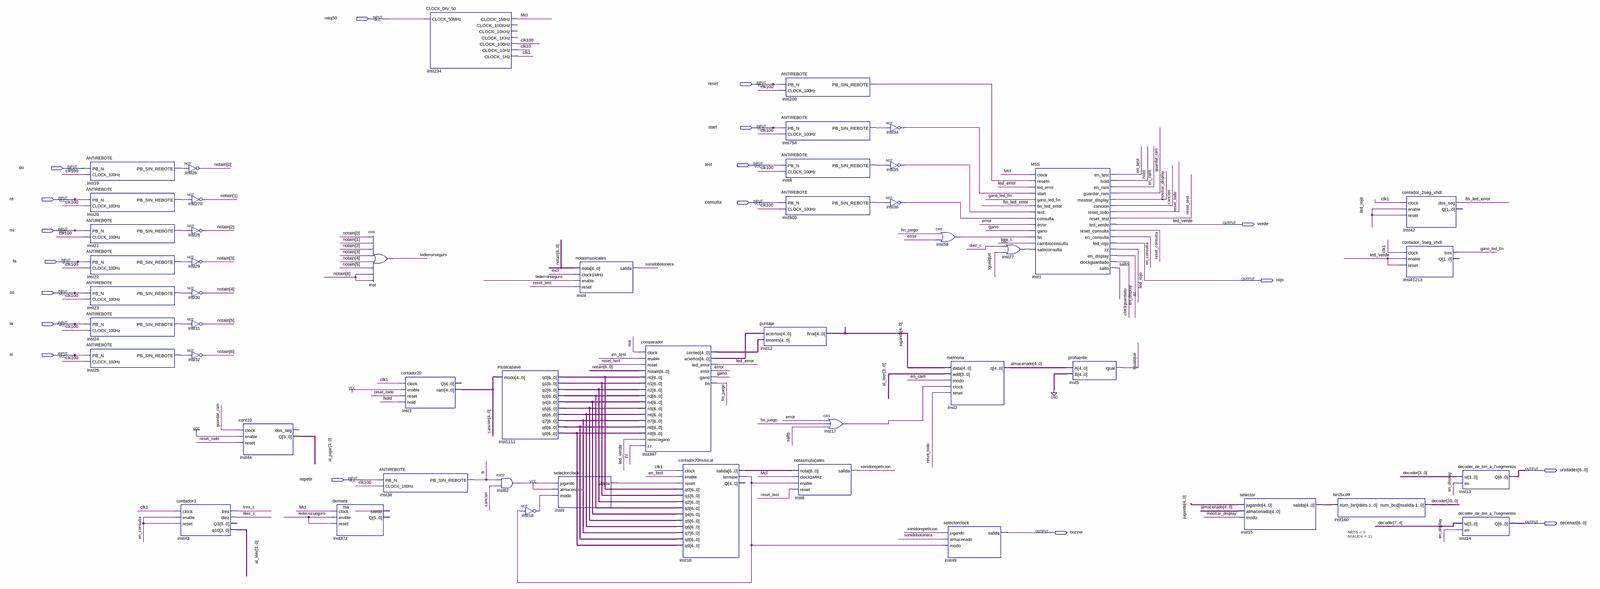
[diagram p0: schematic sheet, whole]
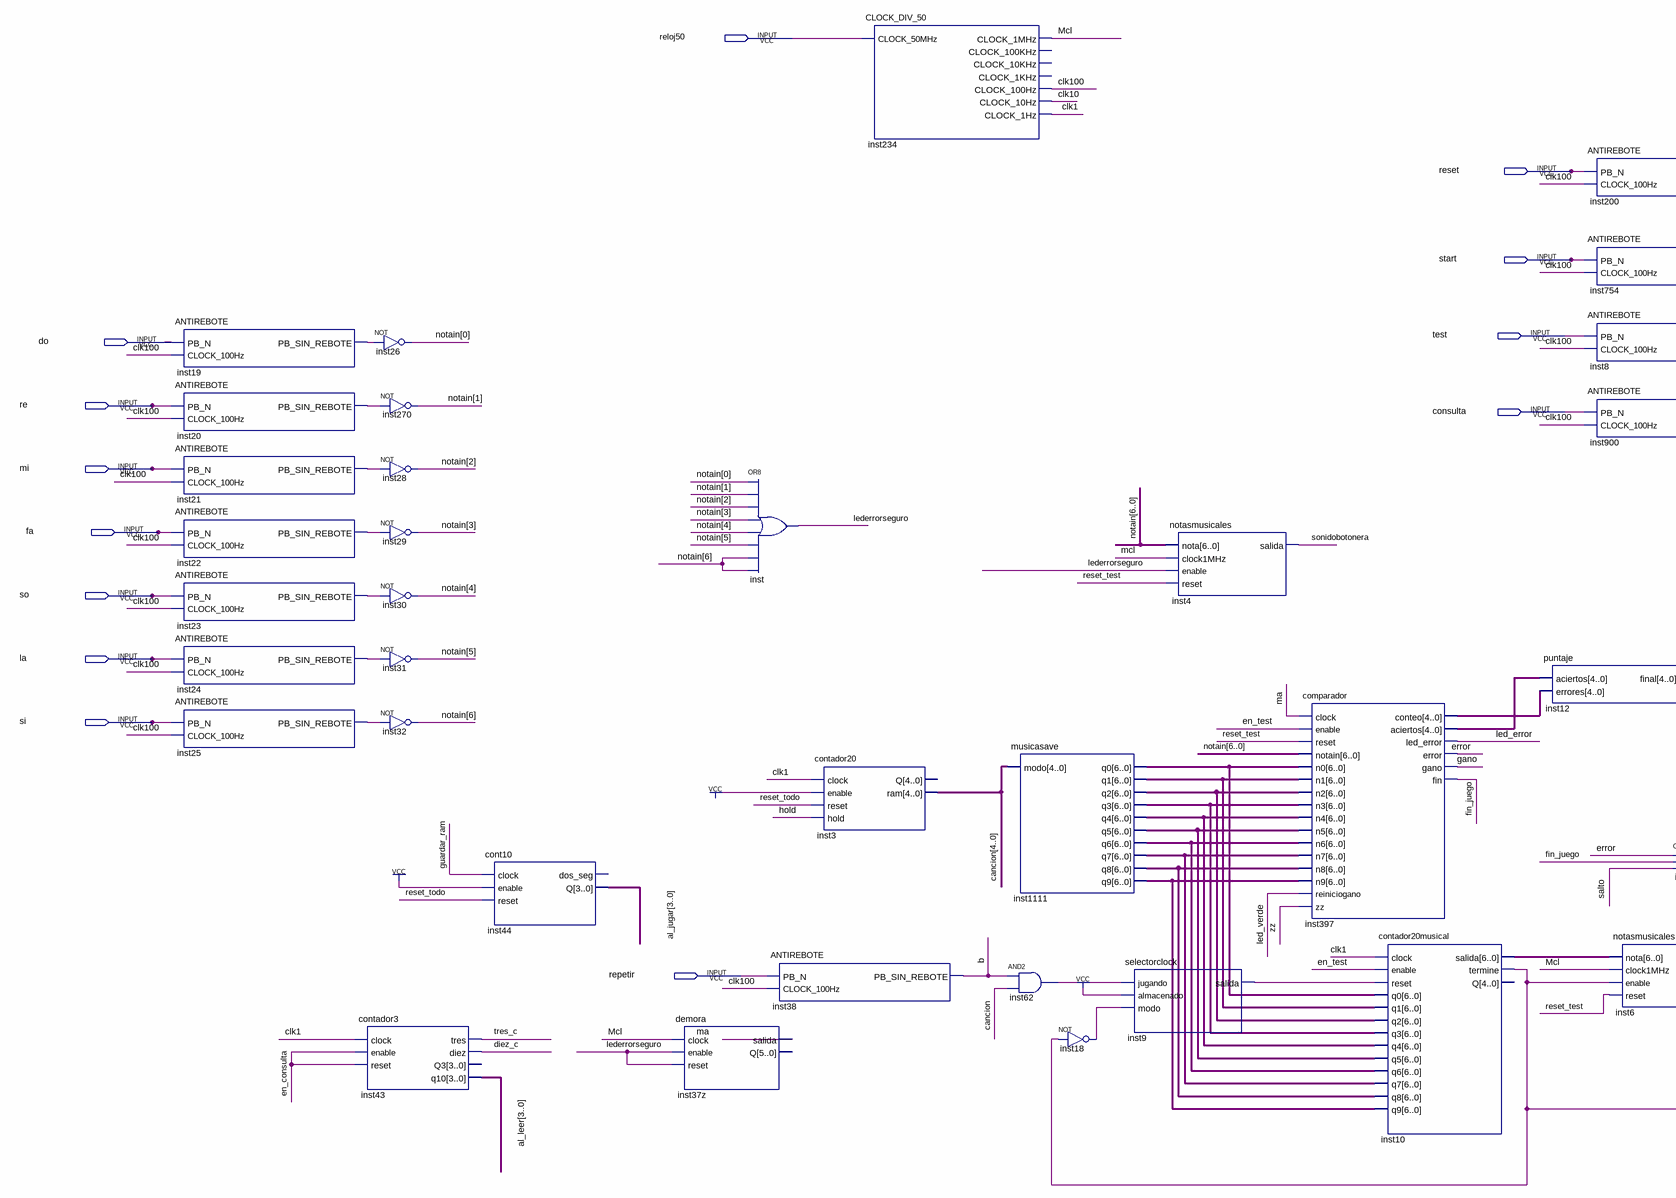
[diagram p1: schematic sheet, left part]
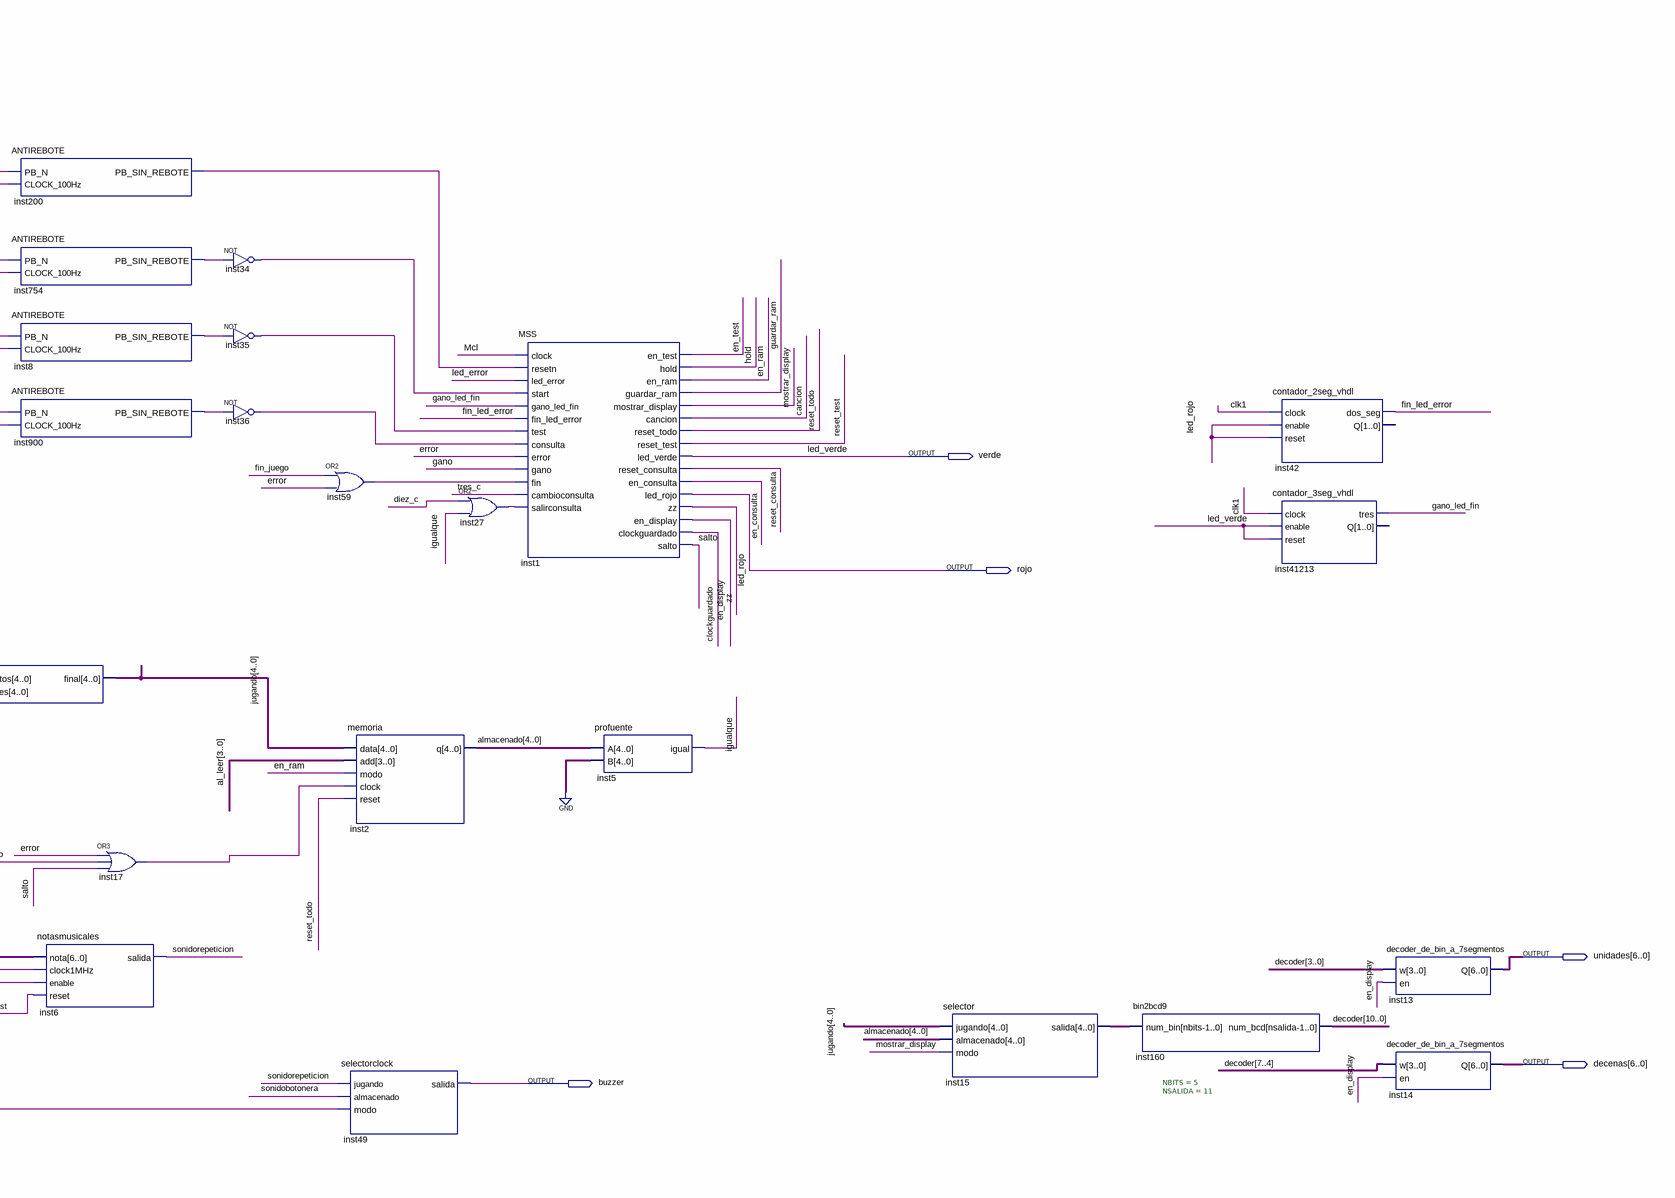
[diagram p2: schematic sheet, right part]
// Quartus schematic musica.bdf as structural Verilog: 50 symbols, 18 pins
module musica (
  input  reloj50,
  input  reset,
  input  start,
  input  test,
  input  \do ,
  input  re,
  input  consulta,
  input  mi,
  input  fa,
  input  so,
  input  la,
  input  si,
  input  repetir,
  output verde,
  output rojo,
  output [6:0] unidades,
  output [6:0] decenas,
  output buzzer
);

  wire b, cancion_1bit, clk1, clk10, clk100, clockguardado, diez_c, en_consulta, en_display, en_ram, en_test,
       error, fin_juego, fin_led_error, gano, gano_led_fin, guardar_ram, hold, igualque, inst8_pb_sin_rebote,
       inst9_salida, inst10_termine, inst17_out, inst18_out, inst19_pb_sin_rebote, inst20_pb_sin_rebote,
       inst21_pb_sin_rebote, inst22_pb_sin_rebote, inst23_pb_sin_rebote, inst24_pb_sin_rebote,
       inst25_pb_sin_rebote, inst27_out, inst34_out, inst35_out, inst36_out, inst59_out, inst62_out,
       inst200_pb_sin_rebote, inst754_pb_sin_rebote, inst900_pb_sin_rebote, led_error, lederrorseguro, ma,
       Mcl, mostrar_display, reset_consulta, reset_test, reset_todo, salto, sonidobotonera, sonidorepeticion,
       tres_c, zz;
  wire [3:0] al_jugar, al_leer;
  wire [4:0] almacenado, cancion, inst15_salida, inst397_aciertos, inst397_conteo, jugando;
  wire [6:0] inst10_salida, inst1111_q0, inst1111_q1, inst1111_q2, inst1111_q3, inst1111_q4, inst1111_q5,
       inst1111_q6, inst1111_q7, inst1111_q8, inst1111_q9, notain;
  wire [10:0] decoder;

  ANTIREBOTE inst19 (.PB_N(\do ), .CLOCK_100Hz(clk100), .PB_SIN_REBOTE(inst19_pb_sin_rebote));
  ANTIREBOTE inst20 (.PB_N(re), .CLOCK_100Hz(clk100), .PB_SIN_REBOTE(inst20_pb_sin_rebote));
  ANTIREBOTE inst21 (.PB_N(mi), .CLOCK_100Hz(clk100), .PB_SIN_REBOTE(inst21_pb_sin_rebote));
  ANTIREBOTE inst22 (.PB_N(fa), .CLOCK_100Hz(clk100), .PB_SIN_REBOTE(inst22_pb_sin_rebote));
  ANTIREBOTE inst23 (.PB_N(so), .CLOCK_100Hz(clk100), .PB_SIN_REBOTE(inst23_pb_sin_rebote));
  ANTIREBOTE inst24 (.PB_N(la), .CLOCK_100Hz(clk100), .PB_SIN_REBOTE(inst24_pb_sin_rebote));
  ANTIREBOTE inst25 (.PB_N(si), .CLOCK_100Hz(clk100), .PB_SIN_REBOTE(inst25_pb_sin_rebote));
  contador3 inst43 (
    .clock(clk1), .enable(en_consulta), .reset(en_consulta), .tres(tres_c), .diez(diez_c), .q10(al_leer));  // open: Q3
  not inst26 (notain[0], inst19_pb_sin_rebote);
  not inst270 (notain[1], inst20_pb_sin_rebote);
  not inst28 (notain[2], inst21_pb_sin_rebote);
  not inst29 (notain[3], inst22_pb_sin_rebote);
  not inst30 (notain[4], inst23_pb_sin_rebote);
  not inst31 (notain[5], inst24_pb_sin_rebote);
  not inst32 (notain[6], inst25_pb_sin_rebote);
  cont10 inst44 (.clock(guardar_ram), .enable(1'b1), .reset(reset_todo), .Q(al_jugar));  // open: dos_seg
  demora inst37z (.clock(Mcl), .enable(lederrorseguro), .reset(lederrorseguro), .salida(ma));  // open: Q
  or inst (lederrorseguro, notain[0], notain[1], notain[2], notain[3], notain[4], notain[5], notain[6], notain[6]);
  ANTIREBOTE inst38 (.PB_N(repetir), .CLOCK_100Hz(clk100), .PB_SIN_REBOTE(b));
  contador20 inst3 (.clock(clk1), .enable(1'b1), .reset(reset_todo), .hold(hold), .ram(cancion));  // open: Q
  CLOCK_DIV_50 inst234 (
    .CLOCK_50MHz(reloj50), .CLOCK_1MHz(Mcl), .CLOCK_100Hz(clk100), .CLOCK_10Hz(clk10), .CLOCK_1Hz(clk1));  // open: CLOCK_100KHz, CLOCK_10KHz, CLOCK_1KHz
  musicasave inst1111 (
    .modo(cancion), .q0(inst1111_q0), .q1(inst1111_q1), .q2(inst1111_q2), .q3(inst1111_q3), .q4(inst1111_q4),
    .q5(inst1111_q5), .q6(inst1111_q6), .q7(inst1111_q7), .q8(inst1111_q8), .q9(inst1111_q9));
  and inst62 (inst62_out, b, cancion_1bit);
  not inst18 (inst18_out, inst10_termine);
  selectorclock inst9 (.jugando(inst62_out), .almacenado(1'b1), .modo(inst18_out), .salida(inst9_salida));
  notasmusicales inst4 (
    .nota(notain), .clock1MHz(Mcl), .enable(lederrorseguro), .reset(reset_test), .salida(sonidobotonera));
  comparador inst397 (
    .clock(ma), .enable(en_test), .reset(reset_test), .notain(notain), .n0(inst1111_q0), .n1(inst1111_q1),
    .n2(inst1111_q2), .n3(inst1111_q3), .n4(inst1111_q4), .n5(inst1111_q5), .n6(inst1111_q6),
    .n7(inst1111_q7), .n8(inst1111_q8), .n9(inst1111_q9), .reiniciogano(verde), .zz(zz),
    .conteo(inst397_conteo), .aciertos(inst397_aciertos), .led_error(led_error), .error(error), .gano(gano),
    .fin(fin_juego));
  contador20musical inst10 (
    .clock(clk1), .enable(en_test), .reset(inst9_salida), .q0(inst1111_q0), .q1(inst1111_q1),
    .q2(inst1111_q2), .q3(inst1111_q3), .q4(inst1111_q4), .q5(inst1111_q5), .q6(inst1111_q6),
    .q7(inst1111_q7), .q8(inst1111_q8), .q9(inst1111_q9), .salida(inst10_salida), .termine(inst10_termine));  // open: Q
  puntaje inst12 (.aciertos(inst397_aciertos), .errores(inst397_conteo), .\final (jugando));
  ANTIREBOTE inst200 (.PB_N(reset), .CLOCK_100Hz(clk100), .PB_SIN_REBOTE(inst200_pb_sin_rebote));
  ANTIREBOTE inst754 (.PB_N(start), .CLOCK_100Hz(clk100), .PB_SIN_REBOTE(inst754_pb_sin_rebote));
  ANTIREBOTE inst8 (.PB_N(test), .CLOCK_100Hz(clk100), .PB_SIN_REBOTE(inst8_pb_sin_rebote));
  ANTIREBOTE inst900 (.PB_N(consulta), .CLOCK_100Hz(clk100), .PB_SIN_REBOTE(inst900_pb_sin_rebote));
  notasmusicales inst6 (
    .nota(inst10_salida), .clock1MHz(Mcl), .enable(inst10_termine), .reset(reset_test),
    .salida(sonidorepeticion));
  or inst17 (inst17_out, error, fin_juego, salto);
  not inst34 (inst34_out, inst754_pb_sin_rebote);
  not inst35 (inst35_out, inst8_pb_sin_rebote);
  not inst36 (inst36_out, inst900_pb_sin_rebote);
  or inst59 (inst59_out, fin_juego, error);
  memoria inst2 (.data(jugando), .add(al_leer), .modo(en_ram), .clock(inst17_out), .reset(reset_todo), .q(almacenado));
  selectorclock inst49 (
    .jugando(sonidorepeticion), .almacenado(sonidobotonera), .modo(inst10_termine), .salida(buzzer));
  or inst27 (inst27_out, diez_c, igualque);
  MSS inst1 (
    .clock(Mcl), .resetn(inst200_pb_sin_rebote), .led_error(led_error), .start(inst34_out),
    .gano_led_fin(gano_led_fin), .fin_led_error(fin_led_error), .test(inst35_out), .consulta(inst36_out),
    .error(error), .gano(gano), .fin(inst59_out), .cambioconsulta(tres_c), .salirconsulta(inst27_out),
    .en_test(en_test), .hold(hold), .en_ram(en_ram), .guardar_ram(guardar_ram),
    .mostrar_display(mostrar_display), .cancion(cancion_1bit), .reset_todo(reset_todo),
    .reset_test(reset_test), .led_verde(verde), .reset_consulta(reset_consulta), .en_consulta(en_consulta),
    .led_rojo(rojo), .zz(zz), .en_display(en_display), .clockguardado(clockguardado), .salto(salto));
  profuente inst5 (.A(almacenado), .B({5{1'b0}}), .igual(igualque));
  selector inst15 (.jugando(jugando), .almacenado(almacenado), .modo(mostrar_display), .salida(inst15_salida));
  bin2bcd9 #(.NBITS(5), .NSALIDA(11)) inst160 (.num_bin(inst15_salida), .num_bcd(decoder));
  contador_2seg_vhdl inst42 (.clock(clk1), .enable(rojo), .reset(rojo), .dos_seg(fin_led_error));  // open: Q
  contador_3seg_vhdl inst41213 (.clock(clk1), .enable(verde), .reset(verde), .tres(gano_led_fin));  // open: Q
  decoder_de_bin_a_7segmentos inst13 (.w(decoder[3:0]), .en(en_display), .Q(unidades));
  decoder_de_bin_a_7segmentos inst14 (.w(decoder[7:4]), .en(en_display), .Q(decenas));

  // Other names for the same wires on the sheet: led_rojo = rojo; led_verde = verde
endmodule
